# Altium schematic sheet buttons.SchDoc: Buttons
size A4; SheetNumber: 13; SheetTotal: 20; TitleBig: Buttons; Desc_line1: TIK buttons. Some of them are meant for debugging like boot mode selection and reset, and will not be accesible to; Desc_line2: the end user. The power-up button and the "thumb" button are meant to be part of the UI.
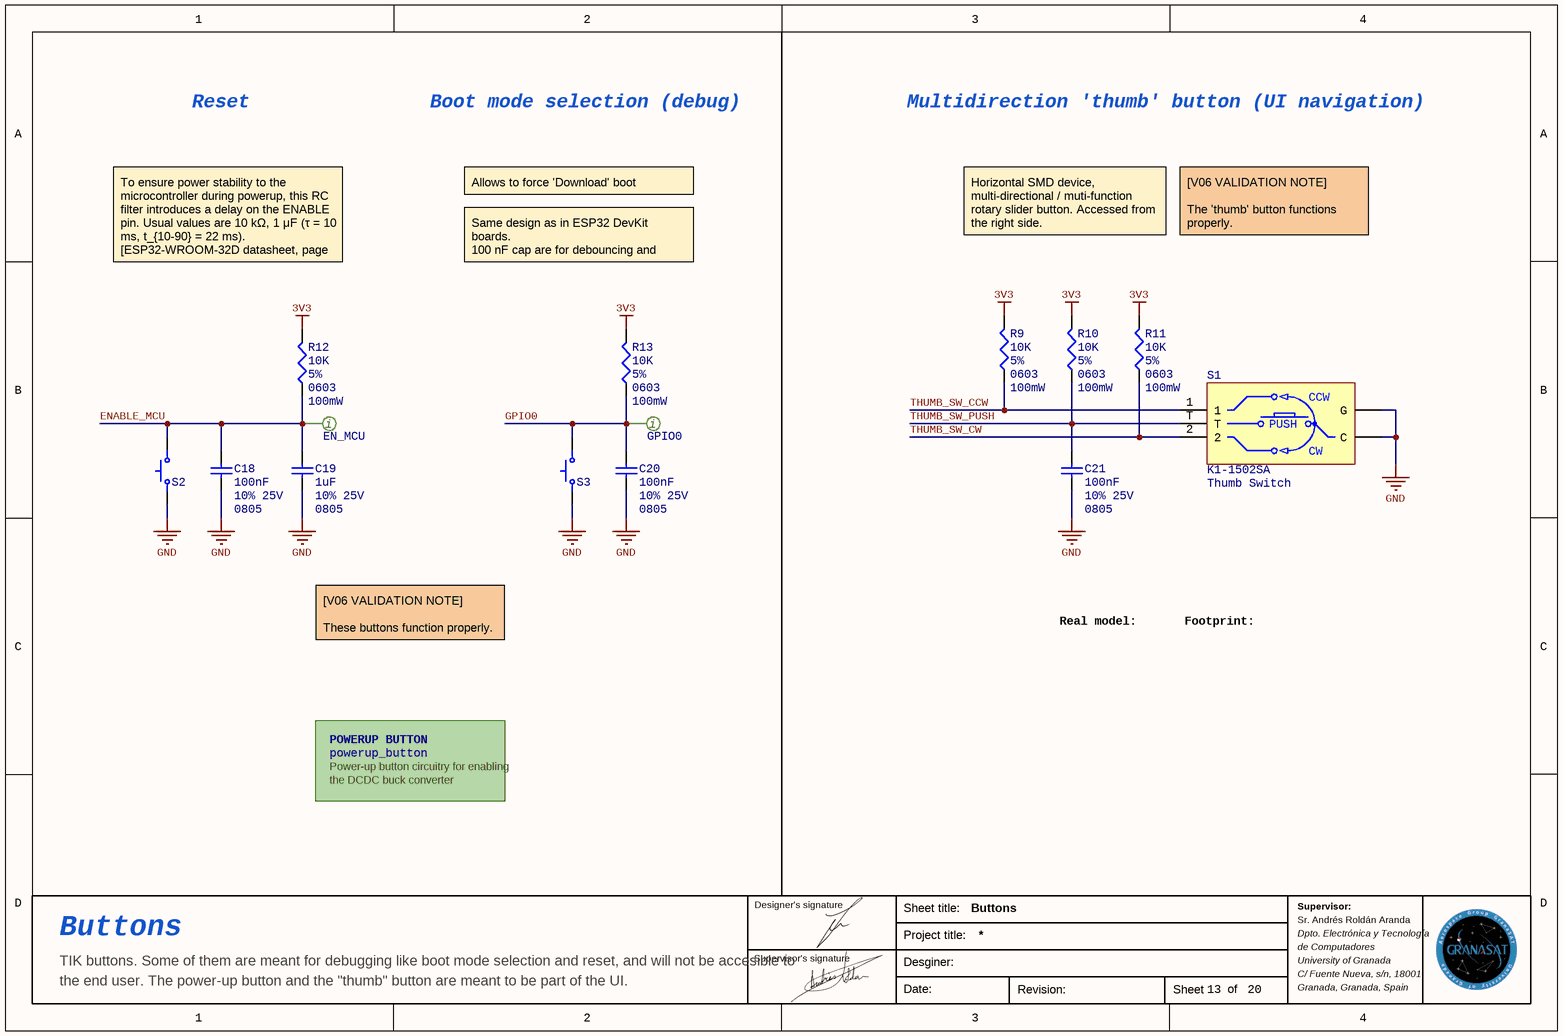
[diagram p0: buttons.SchDoc]

## Parts
C18  value 100nF  Tolerance: 10% 25V  PackageDescription: 0805  [CAP 0805_2012]  (hidden comment: Cap_cer_0805)
C19  value 1uF  Tolerance: 10% 25V  PackageDescription: 0805  [CAP 0805_2012]  (hidden comment: Cap_cer_0805)
C20  value 100nF  Tolerance: 10% 25V  PackageDescription: 0805  [CAP 0805_2012]  (hidden comment: Cap_cer_0805)
C21  value 100nF  Tolerance: 10% 25V  PackageDescription: 0805  [CAP 0805_2012]  (hidden comment: Cap_cer_0805)
EN_MCU  Test Point Pad dual sided  [TEST POINT PAD]  (value not drawn)  (no BOM)
GPIO0  Test Point Pad dual sided  [TEST POINT PAD]  (value not drawn)  (no BOM)
R9  value 10K  Tolerance: 5%  PackageDescription: 0603  PowerDisipated: 100mW  [RES 0603_1608]  (hidden comment: Res_0603_10K_5%_100mW_1)
R10  value 10K  Tolerance: 5%  PackageDescription: 0603  PowerDisipated: 100mW  [RES 0603_1608]  (hidden comment: Res_0603_10K_5%_100mW_1)
R11  value 10K  Tolerance: 5%  PackageDescription: 0603  PowerDisipated: 100mW  [RES 0603_1608]  (hidden comment: Res_0603_10K_5%_100mW_1)
R12  value 10K  Tolerance: 5%  PackageDescription: 0603  PowerDisipated: 100mW  [RES 0603_1608]  (hidden comment: Res_0603_10K_5%_100mW_1)
R13  value 10K  Tolerance: 5%  PackageDescription: 0603  PowerDisipated: 100mW  [RES 0603_1608]  (hidden comment: Res_0603_10K_5%_100mW_1)
S1  Part: K1-1502SA  Type: Thumb Switch  [SWITCH THUMB MULTIDIRECTION K1-1502SA-01]  (hidden comment: SWITCH Multidirection Slide Push Button SMD TS-003)
S2  Button  [button generic]  (value not drawn)
S3  Button  [button generic]  (value not drawn)

## Sub-sheets
POWERUP BUTTON = powerup_button: no entries

## Nets
3V3: R9.2 R10.2 R11.2 R12.2 R13.2
GND: C18.1 C19.1 C20.1 C21.1 S1.C S1.G S2.1 S3.1
ENABLE_MCU: C18.2 C19.2 EN_MCU.1 R12.1 S2.2
GPIO0: C20.2 GPIO0.1 R13.1 S3.2
THUMB_SW_CCW: R9.1 S1.1
THUMB_SW_CW: R11.1 S1.2
THUMB_SW_PUSH: C21.2 R10.1 S1.T

## Notes on the sheet
- Reset
- Boot mode selection (debug)
- Multidirection 'thumb' button (UI navigation)
- Allows to force 'Download' boot sequence
- Horizontal SMD device, multi-directional / muti-function rotary slider button. Accessed from the right side.
- [V06 VALIDATION NOTE]
  The 'thumb' button functions properly.
- To ensure power stability to the microcontroller during powerup, this RC filter introduces a delay on the ENABLE pin. Usual values are 10 kΩ, 1 μF (τ = 10 ms, t_{10-90} = 22 ms).
  [ESP32-WROOM-32D datasheet, page 22]
- Same design as in ESP32 DevKit boards.
  100 nF cap are for debouncing and should be placed close to the buttons
- [V06 VALIDATION NOTE]
  These buttons function properly.
- Real model:
- Footprint:
- Power-up button circuitry for enabling
- the DCDC buck converter
- Designer's signature
- Sheet title:
- Sr. Andrés Roldán Aranda
- Supervisor:
- Supervisor's signature
- Project title:
- Desginer:
- Dpto. Electrónica y Tecnología
- de Computadores
- University of Granada
- C/ Fuente Nueva, s/n, 18001
- Granada, Granada, Spain
- Date:
- Revision:
- Sheet
- of
- (in symbol SWITCH Multidirection Slide Push Button SMD TS-003) CCW; PUSH; CW
- (in symbol Test Point Pad dual sided) i

## Library data of the parts
C18 = Cap_cer_0805_100nF_10%: Ceramic cap size 0805; FabGroup: Buttons - Reset; FabOrder: 11
C19 = Cap_cer_0805_1uF_10%: Ceramic cap size 0805; FabGroup: Buttons - Reset; FabOrder: 11
C20 = Cap_cer_0805_100nF_10%: Ceramic cap size 0805; FabGroup: Buttons - Boot; FabOrder: 10
C21 = Cap_cer_0805_100nF_10%: Ceramic cap size 0805; FabGroup: Buttons - Multipurpose; FabOrder: 9
EN_MCU GPIO0 = Test Point Pad dual sided: Test point - PCB Pad dual sided
R9-R13 = Res_0603_10K_5%_100mW_1: Res size 0603 SMD mounting, low power
S1 = SWITCH Multidirection Slide Push Button SMD TS-003: FabGroup: Buttons - Multipurpose; FabOrder: 9
S2 = Button: Generic 2 pin button; FabGroup: Buttons - Reset; FabOrder: 11; PackageDescription: SMD 2-pin
S3 = Button: Generic 2 pin button; FabGroup: Buttons - Boot; FabOrder: 10; PackageDescription: SMD 2-pin